# EAGLE schematic 0 TO 9 Counter 74LS90 (EAGLE 7.6.0)
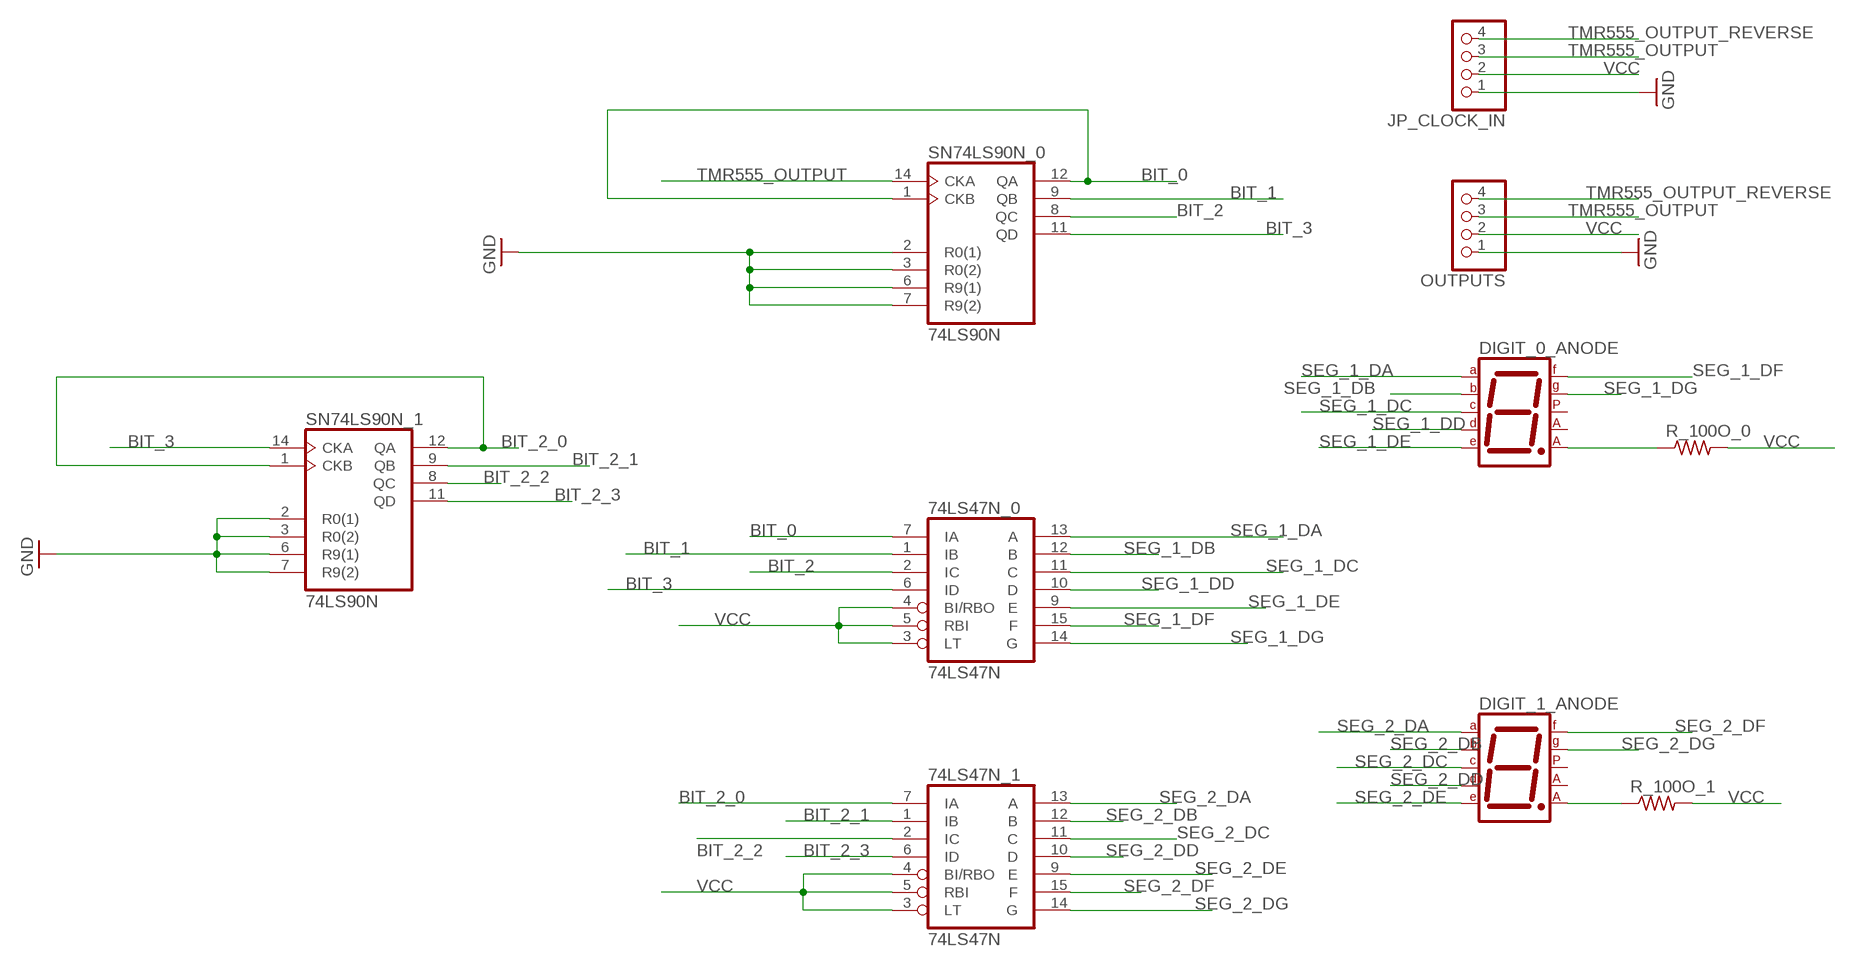
[diagram p0: schematic, sheet 1]

## Parts
74LS47N_0  74LS47N  [DIL16]
74LS47N_1  74LS47N  [DIL16]
DIGIT_0_ANODE  7SEG-CA  [7SEG-13]
DIGIT_1_ANODE  7SEG-CA  [7SEG-13]
JP_CLOCK_IN  PINHD-1X4  [1X04]
OUTPUTS  PINHD-1X4  [1X04]
R_100O_0  R-US_R1206  [R1206]
R_100O_1  R-US_R1206  [R1206]
SN74LS90N_0  74LS90N  [DIL14]
SN74LS90N_1  74LS90N  [DIL14]

## Nets
BIT_0: 74LS47N_0.7(IA) SN74LS90N_0.1(CKB) SN74LS90N_0.12(QA)
BIT_1: 74LS47N_0.1(IB) SN74LS90N_0.9(QB)
BIT_2: 74LS47N_0.2(IC) SN74LS90N_0.8(QC)
BIT_2_0: 74LS47N_1.7(IA) SN74LS90N_1.1(CKB) SN74LS90N_1.12(QA)
BIT_2_1: 74LS47N_1.1(IB) SN74LS90N_1.9(QB)
BIT_2_2: 74LS47N_1.2(IC) SN74LS90N_1.8(QC)
BIT_2_3: 74LS47N_1.6(ID) SN74LS90N_1.11(QD)
BIT_3: 74LS47N_0.6(ID) SN74LS90N_0.11(QD) SN74LS90N_1.14(CKA)
GND: JP_CLOCK_IN.1 OUTPUTS.1 SN74LS90N_0.2(R0(1)) SN74LS90N_0.3(R0(2)) SN74LS90N_0.6(R9(1)) SN74LS90N_0.7(R9(2)) SN74LS90N_1.2(R0(1)) SN74LS90N_1.3(R0(2)) SN74LS90N_1.6(R9(1)) SN74LS90N_1.7(R9(2))
N$1: DIGIT_0_ANODE.8(CA2) R_100O_0.1
N$2: DIGIT_1_ANODE.8(CA2) R_100O_1.1
SEG_1_DA: 74LS47N_0.13(A) DIGIT_0_ANODE.7(A)
SEG_1_DB: 74LS47N_0.12(B) DIGIT_0_ANODE.6(B)
SEG_1_DC: 74LS47N_0.11(C) DIGIT_0_ANODE.4(C)
SEG_1_DD: 74LS47N_0.10(D) DIGIT_0_ANODE.2(D)
SEG_1_DE: 74LS47N_0.9(E) DIGIT_0_ANODE.1(E)
SEG_1_DF: 74LS47N_0.15(F) DIGIT_0_ANODE.9(F)
SEG_1_DG: 74LS47N_0.14(G) DIGIT_0_ANODE.10(G)
SEG_2_DA: 74LS47N_1.13(A) DIGIT_1_ANODE.7(A)
SEG_2_DB: 74LS47N_1.12(B) DIGIT_1_ANODE.6(B)
SEG_2_DC: 74LS47N_1.11(C) DIGIT_1_ANODE.4(C)
SEG_2_DD: 74LS47N_1.10(D) DIGIT_1_ANODE.2(D)
SEG_2_DE: 74LS47N_1.9(E) DIGIT_1_ANODE.1(E)
SEG_2_DF: 74LS47N_1.15(F) DIGIT_1_ANODE.9(F)
SEG_2_DG: 74LS47N_1.14(G) DIGIT_1_ANODE.10(G)
TMR555_OUTPUT: JP_CLOCK_IN.3 OUTPUTS.3 SN74LS90N_0.14(CKA)
TMR555_OUTPUT_REVERSE: JP_CLOCK_IN.4 OUTPUTS.4
VCC: 74LS47N_0.3(LT) 74LS47N_0.4(BI/RBO) 74LS47N_0.5(RBI) 74LS47N_1.3(LT) 74LS47N_1.4(BI/RBO) 74LS47N_1.5(RBI) JP_CLOCK_IN.2 OUTPUTS.2 R_100O_0.2 R_100O_1.2
Unconnected: DIGIT_0_ANODE.3(CA1) DIGIT_0_ANODE.5(DP) DIGIT_1_ANODE.3(CA1) DIGIT_1_ANODE.5(DP)

## Power pins joined to a net without a drawn wire
GND: 74LS47N_0.8(GND) 74LS47N_1.8(GND) SN74LS90N_0.10(GND) SN74LS90N_1.10(GND)
VCC: 74LS47N_0.16(VCC) 74LS47N_1.16(VCC) SN74LS90N_0.5(VCC) SN74LS90N_1.5(VCC)

## Library data of the parts
74LS47N_0 74LS47N_1 = 74xx-us:74*47: BCD to seven segment DECODER/DRIVER Source: http://www.ee.washington.edu/stores/DataSheets/74ls/74ls47.pdf
DIGIT_0_ANODE DIGIT_1_ANODE = special:7SEG-CA: 7-segment DISPLAY single anode, 13 mm
JP_CLOCK_IN OUTPUTS = pinhead:PINHD-1X4: PIN HEADER
R_100O_0 R_100O_1 = adafruit:R-US_: RESISTOR, American symbol
SN74LS90N_0 SN74LS90N_1 = 74xx-us:74*90: Decade, divide by twelve and binary COUNTER